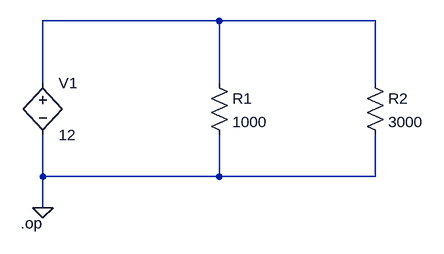
[diagram p0: schematic CurrentDivider.asc]
CurrentDivider.asc, the LTspice schematic file:
Version 4
SHEET 1 880 680
WIRE 336 32 64 32
WIRE 576 32 336 32
WIRE 64 128 64 32
WIRE 336 128 336 32
WIRE 576 128 576 32
WIRE 64 272 64 208
WIRE 336 272 336 208
WIRE 336 272 64 272
WIRE 576 272 576 208
WIRE 576 272 336 272
WIRE 64 320 64 272
FLAG 64 320 0
SYMBOL h 64 112 R0
WINDOW 123 0 0 Left 0
WINDOW 39 0 0 Left 0
SYMATTR InstName V1
SYMATTR Value 12
SYMATTR Prefix V
SYMBOL res 320 112 R0
SYMATTR InstName R1
SYMATTR Value 1000
SYMBOL res 560 112 R0
SYMATTR InstName R2
SYMATTR Value 3000
TEXT 30 344 Left 2 !.op

The netlist it stands for:
* CurrentDivider.asc
V1 N001 0 12
R1 N001 0 1000
R2 N001 0 3000
.op
.backanno
.end